# EAGLE design v002 (EAGLE 6.4)
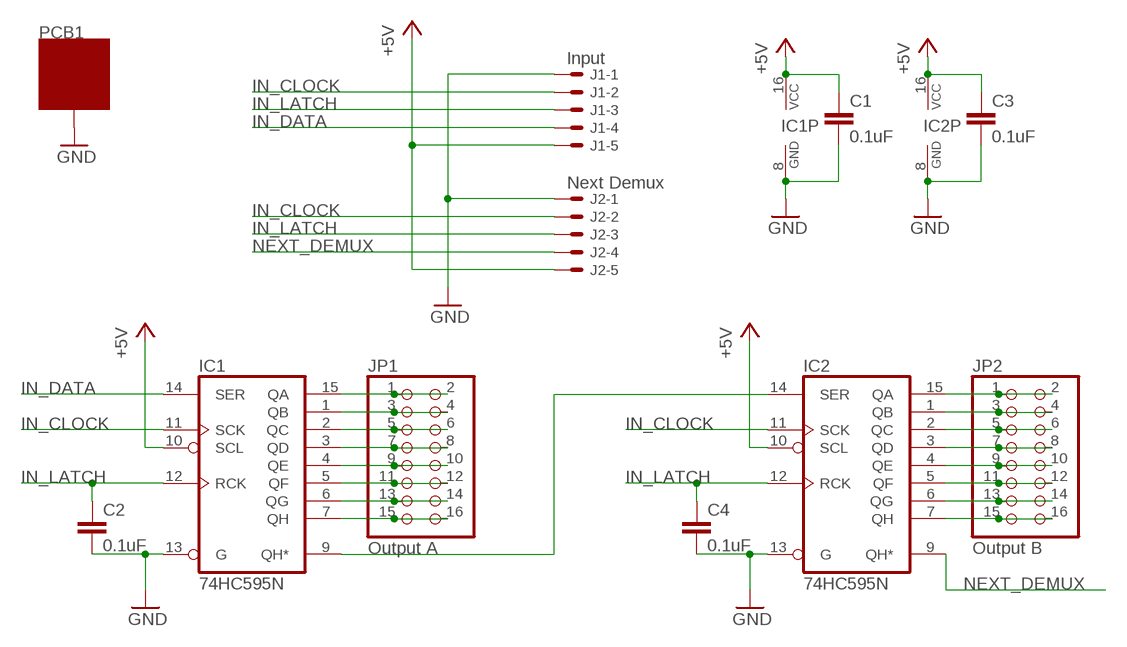
[diagram p0: schematic, sheet 1]

## Parts
C1  0.1uF  C-EU050-024X044  [C050-024X044]
C2  0.1uF  C-EU050-024X044  [C050-024X044]
C3  0.1uF  C-EU050-024X044  [C050-024X044]
C4  0.1uF  C-EU050-024X044  [C050-024X044]
IC1  74HC595N  [DIL16]
IC2  74HC595N  [DIL16]
J1  Input  22-27-2051-05  [6410-05]
J2  Next Demux  22-27-2051-05  [6410-05]
JP1  Output A  PINHD-2X8  [2X08]
JP2  Output B  PINHD-2X8  [2X08]
PCB1  ZZZ_MODULE05X05  [ZZZ_MODULE_05X05]

## Nets
+5V: C1.1 C3.1 IC1.10(SCL) IC1.16(VCC) IC2.10(SCL) IC2.16(VCC) J1.5 J2.5
GND: C1.2 C2.2 C3.2 C4.2 IC1.8(GND) IC1.13(G) IC2.8(GND) IC2.13(G) J1.1 J2.1 PCB1.GND@1(GND) PCB1.GND@2(GND) PCB1.GND@3(GND) PCB1.GND@4(GND) PCB1.GND@5(GND) PCB1.GND@6(GND) PCB1.GND@7(GND) PCB1.GND@8(GND)
IN_CLOCK: IC1.11(SCK) IC2.11(SCK) J1.2 J2.2
IN_DATA: IC1.14(SER) J1.4
IN_LATCH: C2.1 C4.1 IC1.12(RCK) IC2.12(RCK) J1.3 J2.3
N$1: IC1.15(QA) JP1.1 JP1.2
N$2: IC1.1(QB) JP1.3 JP1.4
N$3: IC1.2(QC) JP1.5 JP1.6
N$4: IC1.3(QD) JP1.7 JP1.8
N$5: IC1.4(QE) JP1.9 JP1.10
N$6: IC1.5(QF) JP1.11 JP1.12
N$7: IC1.6(QG) JP1.13 JP1.14
N$8: IC1.7(QH) JP1.15 JP1.16
N$10: IC2.15(QA) JP2.1 JP2.2
N$11: IC2.1(QB) JP2.3 JP2.4
N$12: IC2.2(QC) JP2.5 JP2.6
N$13: IC2.3(QD) JP2.7 JP2.8
N$14: IC2.4(QE) JP2.9 JP2.10
N$15: IC2.5(QF) JP2.11 JP2.12
N$16: IC2.6(QG) JP2.13 JP2.14
N$17: IC2.7(QH) JP2.15 JP2.16
N$18: IC1.9(QH*) IC2.14(SER)
NEXT_DEMUX: IC2.9(QH*) J2.4

## Library data of the parts
C1-C4 = rcl:C-EU: CAPACITOR, European symbol
IC1 IC2 = 74xx-eu:74*595: 8-bit SHIFT REGISTER, output latch
J1 J2 = con-molex:22-?-05: CONNECTOR wire to board 2.54 mm (.1 inch) pitch header; OC_FARNELL: unknown; OC_NEWARK: unknown
JP1 JP2 = pinhead:PINHD-2X8: PIN HEADER
PCB1 = GNLib:ZZZ_MODULE

## Board
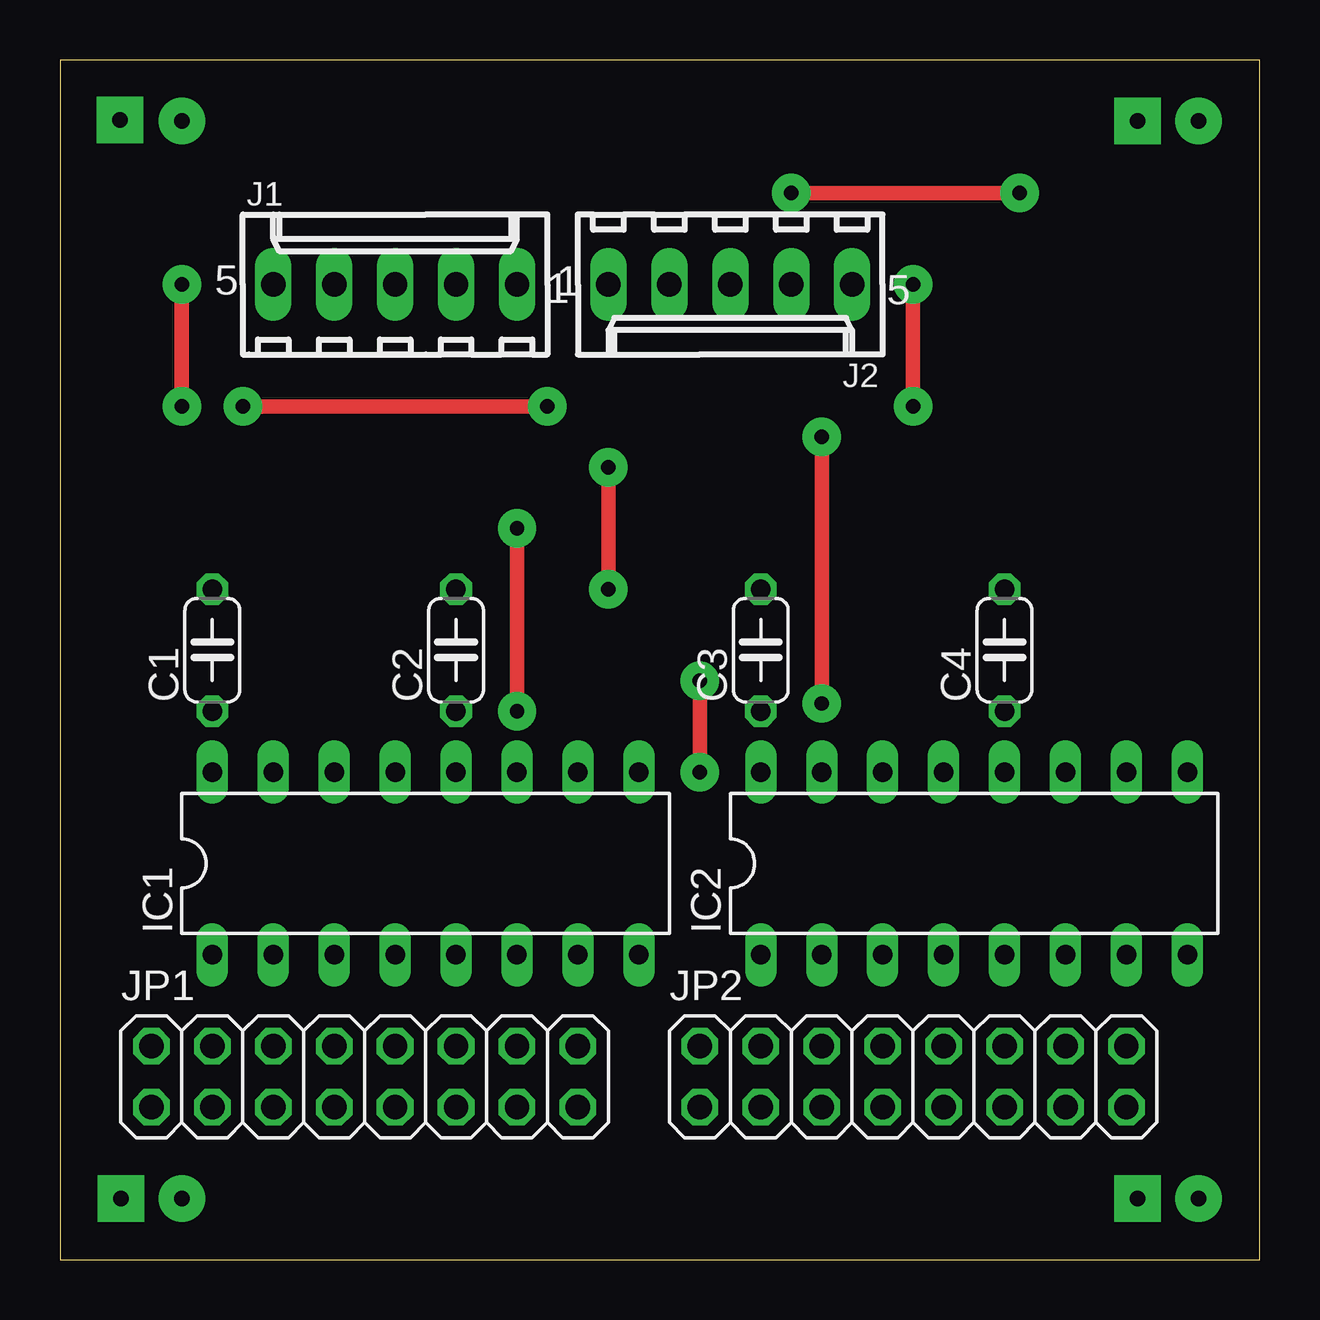
[diagram p1: board, top side]
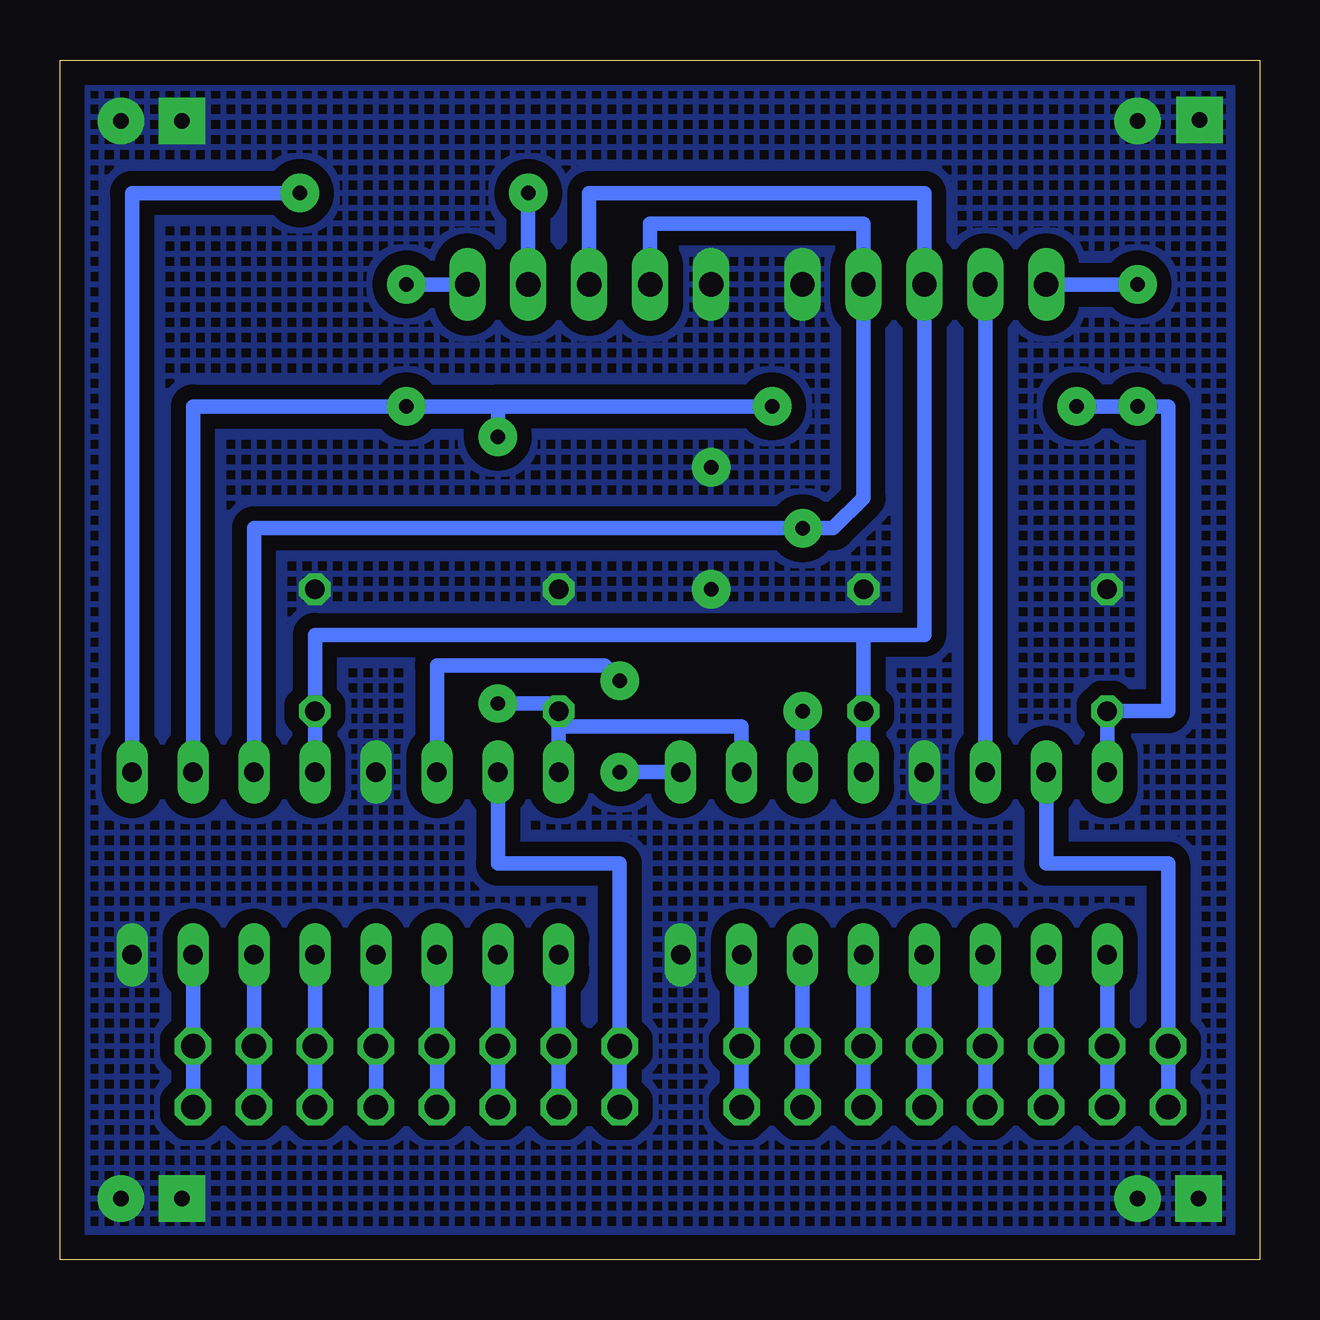
[diagram p2: board, bottom side, seen from below]

Size 50 x 50 mm. Coordinates in mm from the lower left corner, seen from the top.
Outline: 0,0 50,0 50,50 0,50 0,0
Copper layers (1*16): Top 0.035mm / dielectric 1.5mm / Bottom 0.035mm
Design rules "default": minimum track width 10mil, minimum drill 24mil, track to track 8mil, track to pad 8mil, pad to pad 8mil, via to via 8mil, smd to smd 8mil, copper to edge 40mil, drill to drill 8mil, minimum pad ring 10mil, minimum via ring 8mil, stop-mask expansion 4mil, vias tented up to drill 0mil, thermal gap 10mil

### Footprints (pad centres in the part's own frame; a part is rotated, then mirrored left to right if it is on the bottom)
C050-024X044 = drill 0.813 octagon: 1 -2.54,0; 2 2.54,0
DIL16 = drill 0.813 long: 1 -8.89,-3.81; 2 -6.35,-3.81; 3 -3.81,-3.81; 4 -1.27,-3.81; 5 1.27,-3.81; 6 3.81,-3.81; 7 6.35,-3.81; 8 8.89,-3.81; 9 8.89,3.81; 10 6.35,3.81; 11 3.81,3.81; 12 1.27,3.81; 13 -1.27,3.81; 14 -3.81,3.81; 15 -6.35,3.81; 16 -8.89,3.81
6410-05 = drill 1.016 long: 1 5.08,0; 2 2.54,0; 3 0,0; 4 -2.54,0; 5 -5.08,0
2X08 = drill 1.016 octagon: 1 -8.89,-1.27; 2 -8.89,1.27; 3 -6.35,-1.27; 4 -6.35,1.27; 5 -3.81,-1.27; 6 -3.81,1.27; 7 -1.27,-1.27; 8 -1.27,1.27; 9 1.27,-1.27; 10 1.27,1.27; 11 3.81,-1.27; 12 3.81,1.27; 13 6.35,-1.27; 14 6.35,1.27; 15 8.89,-1.27; 16 8.89,1.27
ZZZ_MODULE_05X05 = drill 0.64 pad 1.93 square: GND@1 2.5,47.5; GND@2 44.92,47.46; GND@7 2.54,2.54; GND@8 44.92,2.54 | drill 0.64 pad 1.93: GND@3 47.46,47.46; GND@4 5.08,47.46; GND@5 47.46,2.54; GND@6 5.08,2.54

### Placement (x,y rotation side)
C1  6.35,25.4 90 top
C2  16.51,25.4 90 top
C3  29.21,25.4 90 top
C4  39.37,25.4 90 top
IC1  15.24,16.51 0 top
IC2  38.1,16.51 0 top
J1  13.97,40.64 0 top
J2  27.94,40.64 180 top
JP1  12.7,7.62 0 top
JP2  35.56,7.62 0 top
PCB1  0,0 0 top

### Tracks (layer width: path | path; a pad name or v marks a point on that pad's centre or on a via)
+5V  (via drill 0.6 pad 1.6)
  Top 0.61: v7.62,35.56 v20.32,35.56 | v31.75,23.18 v31.75,34.29 | v5.08,40.64 v5.08,35.56 | v35.56,40.64 v35.56,35.56
  Bottom 0.61: 29.21,22.23 C3.1 29.53,23.18 v31.75,23.18 | 29.21,22.23 IC2.16 | IC1.16 C1.1 3.81,22.86 3.81,35.56 v5.08,35.56 v7.62,35.56 | v20.32,35.56 31.75,35.56 | v31.75,34.29 31.75,35.56 | IC2.10 44.45,35.56 v35.56,35.56 31.75,35.56 | IC1.10 21.59,22.23 29.21,22.23 | J2.5 v35.56,40.64 | J1.5 v5.08,40.64
GND  (via drill 0.6 pad 1.6)
  Top 0.61: v22.86,27.94 v22.86,33.02
  pour Bottom (isolate 0.61, no thermals, hatched): 0,50 50,50 50,0 0,0
IN_CLOCK  (via drill 0.6 pad 1.6)
  Top 0.61: v19.05,30.48 v19.05,22.86
  Bottom 0.61: v19.05,22.86 IC1.11 | IC2.11 41.91,30.48 v19.05,30.48 17.78,30.48 16.51,31.75 J1.2 16.51,43.18 25.4,43.18 J2.2
IN_DATA
  Bottom 0.61: J1.4 IC1.14
IN_LATCH
  Bottom 0.61: IC1.12 C2.1 16.51,26.04 | IC2.12 C4.1 39.37,26.04 16.51,26.04 | 16.51,26.04 13.97,26.04 J1.3 13.97,44.45 27.94,44.45 J2.3
N$1
  Bottom 0.61: JP1.1 JP1.2 3.81,16.51 8.89,16.51 IC1.15
N$2
  Bottom 0.61: IC1.1 JP1.4 JP1.3
N$3
  Bottom 0.61: IC1.2 JP1.6 JP1.5
N$4
  Bottom 0.61: IC1.3 JP1.8 JP1.7
N$5
  Bottom 0.61: IC1.4 JP1.10 JP1.9
N$6
  Bottom 0.61: IC1.5 JP1.12 JP1.11
N$7
  Bottom 0.61: IC1.6 JP1.14 JP1.13
N$8
  Bottom 0.61: IC1.7 JP1.16 JP1.15
N$10
  Bottom 0.61: JP2.1 JP2.2 26.67,16.51 31.75,16.51 IC2.15
N$11
  Bottom 0.61: IC2.1 JP2.4 JP2.3
N$12
  Bottom 0.61: IC2.2 JP2.6 JP2.5
N$13
  Bottom 0.61: JP2.7 JP2.8 IC2.3
N$14
  Bottom 0.61: IC2.4 JP2.10 JP2.9
N$15
  Bottom 0.61: IC2.5 JP2.12 JP2.11
N$16
  Bottom 0.61: IC2.6 JP2.14 JP2.13
N$17
  Bottom 0.61: IC2.7 JP2.16 JP2.15
N$18  (via drill 0.6 pad 1.6)
  Top 0.61: v26.67,20.32 v26.67,24.13
  Bottom 0.61: IC1.9 v26.67,20.32 | IC2.14 34.29,24.77 27.3,24.77 v26.67,24.13
NEXT_DEMUX  (via drill 0.6 pad 1.6)
  Top 0.61: v30.48,44.45 v40.01,44.45
  Bottom 0.61: IC2.9 46.99,44.45 v40.01,44.45 | v30.48,44.45 J2.4